# Altium schematic sheet P01.ModsConn.SchDoc
size A4
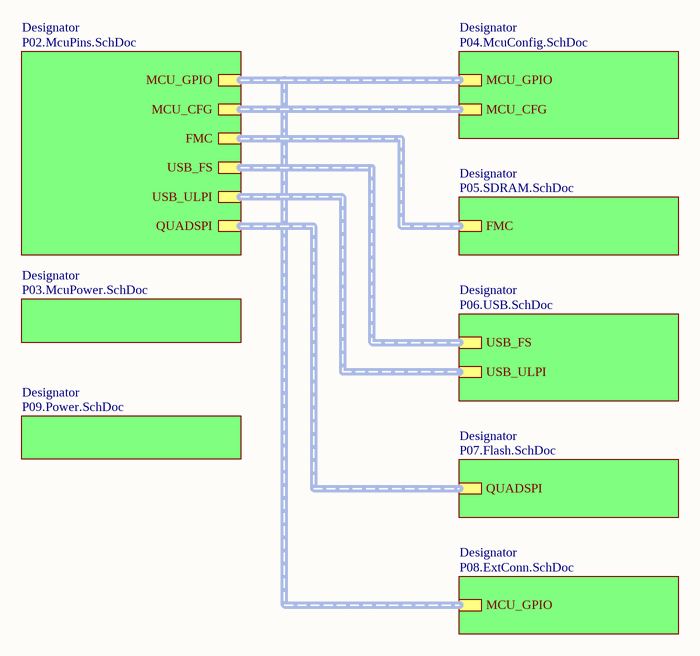
[diagram p0: P01.ModsConn.SchDoc]

## Sub-sheets
Designator = P02.McuPins.SchDoc: USB_FS (harness USB_FS), MCU_GPIO (harness MCU_GPIO), MCU_CFG (harness MCU_CFG), USB_ULPI (harness USB_ULPI), FMC (harness FMC), QUADSPI (harness QUADSPI)
Designator = P04.McuConfig.SchDoc: MCU_CFG (harness MCU_CFG), MCU_GPIO (harness MCU_GPIO)
Designator = P05.SDRAM.SchDoc: FMC (harness FMC)
Designator = P06.USB.SchDoc: USB_ULPI (harness USB_ULPI), USB_FS (harness USB_FS)
Designator = P03.McuPower.SchDoc: no entries
Designator = P07.Flash.SchDoc: QUADSPI (harness QUADSPI)
Designator = P08.ExtConn.SchDoc: MCU_GPIO (harness MCU_GPIO)
Designator = P09.Power.SchDoc: no entries